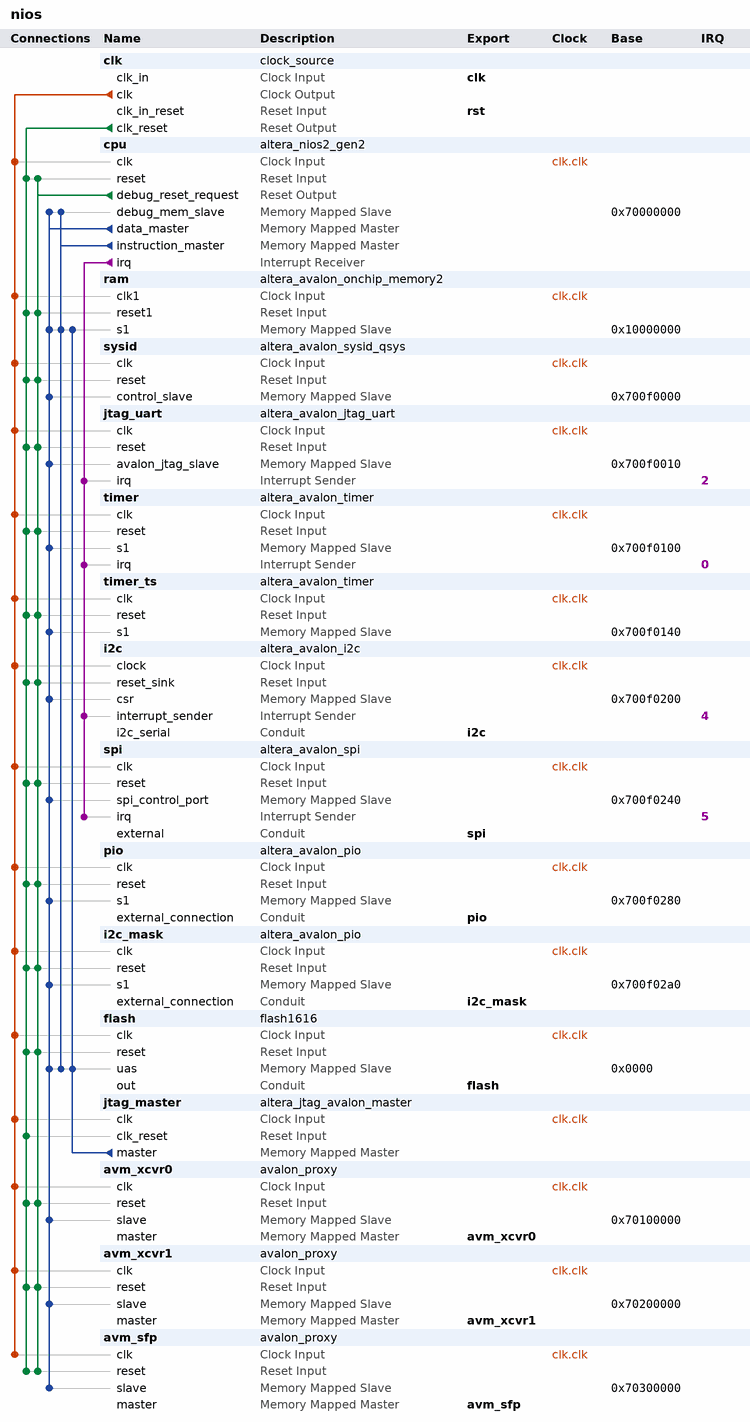
[diagram p0: system contents]
# Platform Designer (Qsys) system nios, Arria 10 10AX115N2F45E1SG
# Parameters at their usual value, and those the tool derives, are not listed.
package require -exact qsys 18.1
create_system nios
set_project_property DEVICE_FAMILY {Arria 10}
set_project_property DEVICE 10AX115N2F45E1SG

add_instance clk clock_source 18.1
set_instance_parameter_value clk clockFrequency 50000000
set_instance_parameter_value clk resetSynchronousEdges DEASSERT

add_instance cpu altera_nios2_gen2 18.1
set_instance_parameter_value cpu dcache_size 2048
set_instance_parameter_value cpu exceptionSlave ram.s1
set_instance_parameter_value cpu icache_size 4096
set_instance_parameter_value cpu impl Tiny
set_instance_parameter_value cpu io_regionbase 1879048192
set_instance_parameter_value cpu io_regionsize 268435456
set_instance_parameter_value cpu resetOffset 98828288
set_instance_parameter_value cpu resetSlave flash.uas

add_instance ram altera_avalon_onchip_memory2 18.1
set_instance_parameter_value ram dataWidth 32
set_instance_parameter_value ram dualPort false
set_instance_parameter_value ram initMemContent true
set_instance_parameter_value ram initializationFileName output_files/nios_ram.hex
set_instance_parameter_value ram memorySize 524288
set_instance_parameter_value ram useNonDefaultInitFile true

add_instance sysid altera_avalon_sysid_qsys 18.1
set_instance_parameter_value sysid id 0

add_instance jtag_uart altera_avalon_jtag_uart 18.1
set_instance_parameter_value jtag_uart simInteractiveOptions NO_INTERACTIVE_WINDOWS

add_instance timer altera_avalon_timer 18.1
set_instance_parameter_value timer alwaysRun true
set_instance_parameter_value timer fixedPeriod true
set_instance_parameter_value timer period 1
set_instance_parameter_value timer periodUnits MSEC
set_instance_parameter_value timer snapshot false

add_instance timer_ts altera_avalon_timer 18.1
set_instance_parameter_value timer_ts period 1
set_instance_parameter_value timer_ts periodUnits MSEC

add_instance i2c altera_avalon_i2c 18.1
set_instance_parameter_value i2c FIFO_DEPTH 4

add_instance spi altera_avalon_spi 18.1
set_instance_parameter_value spi clockPolarity 0
set_instance_parameter_value spi dataWidth 8
set_instance_parameter_value spi masterSPI true
set_instance_parameter_value spi numberOfSlaves 32
set_instance_parameter_value spi targetClockRate 128000

add_instance pio altera_avalon_pio 18.1
set_instance_parameter_value pio bitModifyingOutReg true
set_instance_parameter_value pio direction Output
set_instance_parameter_value pio width 32

add_instance i2c_mask altera_avalon_pio 18.1
set_instance_parameter_value i2c_mask bitModifyingOutReg true
set_instance_parameter_value i2c_mask direction Output
set_instance_parameter_value i2c_mask width 32

add_instance flash flash1616 1.0
set_instance_parameter_value flash address_width 28
set_instance_parameter_value flash clockFrequency 50000000
set_instance_parameter_value flash data_hold 33
set_instance_parameter_value flash rw_wait 144
set_instance_parameter_value flash setup_wait 33

add_instance jtag_master altera_jtag_avalon_master 18.1

add_instance avm_xcvr0 avalon_proxy 1.1
set_instance_parameter_value avm_xcvr0 ADDRESS_UNITS 32
set_instance_parameter_value avm_xcvr0 ADDRESS_WIDTH 18
set_instance_parameter_value avm_xcvr0 DATA_WIDTH 32
set_instance_parameter_value avm_xcvr0 READ_LATENCY 0
set_instance_parameter_value avm_xcvr0 USE_READ_DATA_VALID false

add_instance avm_xcvr1 avalon_proxy 1.1
set_instance_parameter_value avm_xcvr1 ADDRESS_UNITS 32
set_instance_parameter_value avm_xcvr1 ADDRESS_WIDTH 18
set_instance_parameter_value avm_xcvr1 DATA_WIDTH 32
set_instance_parameter_value avm_xcvr1 READ_LATENCY 0
set_instance_parameter_value avm_xcvr1 USE_READ_DATA_VALID false

add_instance avm_sfp avalon_proxy 1.1
set_instance_parameter_value avm_sfp ADDRESS_UNITS 32
set_instance_parameter_value avm_sfp ADDRESS_WIDTH 14
set_instance_parameter_value avm_sfp DATA_WIDTH 32
set_instance_parameter_value avm_sfp READ_LATENCY 0
set_instance_parameter_value avm_sfp USE_READ_DATA_VALID false

# connections
add_connection clk.clk avm_sfp.clk clock
add_connection clk.clk avm_xcvr0.clk clock
add_connection clk.clk avm_xcvr1.clk clock
add_connection clk.clk cpu.clk clock
add_connection clk.clk flash.clk clock
add_connection clk.clk i2c.clock clock
add_connection clk.clk i2c_mask.clk clock
add_connection clk.clk jtag_master.clk clock
add_connection clk.clk jtag_uart.clk clock
add_connection clk.clk pio.clk clock
add_connection clk.clk ram.clk1 clock
add_connection clk.clk spi.clk clock
add_connection clk.clk sysid.clk clock
add_connection clk.clk timer.clk clock
add_connection clk.clk timer_ts.clk clock
add_connection clk.clk_reset avm_sfp.reset reset
add_connection clk.clk_reset avm_xcvr0.reset reset
add_connection clk.clk_reset avm_xcvr1.reset reset
add_connection clk.clk_reset cpu.reset reset
add_connection clk.clk_reset flash.reset reset
add_connection clk.clk_reset i2c.reset_sink reset
add_connection clk.clk_reset i2c_mask.reset reset
add_connection clk.clk_reset jtag_master.clk_reset reset
add_connection clk.clk_reset jtag_uart.reset reset
add_connection clk.clk_reset pio.reset reset
add_connection clk.clk_reset ram.reset1 reset
add_connection clk.clk_reset spi.reset reset
add_connection clk.clk_reset sysid.reset reset
add_connection clk.clk_reset timer.reset reset
add_connection clk.clk_reset timer_ts.reset reset
add_connection cpu.debug_reset_request avm_sfp.reset reset
add_connection cpu.debug_reset_request avm_xcvr0.reset reset
add_connection cpu.debug_reset_request avm_xcvr1.reset reset
add_connection cpu.debug_reset_request cpu.reset reset
add_connection cpu.debug_reset_request flash.reset reset
add_connection cpu.debug_reset_request i2c.reset_sink reset
add_connection cpu.debug_reset_request i2c_mask.reset reset
add_connection cpu.debug_reset_request jtag_uart.reset reset
add_connection cpu.debug_reset_request pio.reset reset
add_connection cpu.debug_reset_request ram.reset1 reset
add_connection cpu.debug_reset_request spi.reset reset
add_connection cpu.debug_reset_request sysid.reset reset
add_connection cpu.debug_reset_request timer.reset reset
add_connection cpu.debug_reset_request timer_ts.reset reset
add_connection cpu.data_master avm_sfp.slave avalon
set_connection_parameter_value cpu.data_master/avm_sfp.slave baseAddress 0x70300000
add_connection cpu.data_master avm_xcvr0.slave avalon
set_connection_parameter_value cpu.data_master/avm_xcvr0.slave baseAddress 0x70100000
add_connection cpu.data_master avm_xcvr1.slave avalon
set_connection_parameter_value cpu.data_master/avm_xcvr1.slave baseAddress 0x70200000
add_connection cpu.data_master cpu.debug_mem_slave avalon
set_connection_parameter_value cpu.data_master/cpu.debug_mem_slave baseAddress 0x70000000
add_connection cpu.data_master flash.uas avalon
set_connection_parameter_value cpu.data_master/flash.uas baseAddress 0x0000
add_connection cpu.data_master i2c.csr avalon
set_connection_parameter_value cpu.data_master/i2c.csr baseAddress 0x700f0200
add_connection cpu.data_master i2c_mask.s1 avalon
set_connection_parameter_value cpu.data_master/i2c_mask.s1 baseAddress 0x700f02a0
add_connection cpu.data_master jtag_uart.avalon_jtag_slave avalon
set_connection_parameter_value cpu.data_master/jtag_uart.avalon_jtag_slave baseAddress 0x700f0010
add_connection cpu.data_master pio.s1 avalon
set_connection_parameter_value cpu.data_master/pio.s1 baseAddress 0x700f0280
add_connection cpu.data_master ram.s1 avalon
set_connection_parameter_value cpu.data_master/ram.s1 baseAddress 0x10000000
add_connection cpu.data_master spi.spi_control_port avalon
set_connection_parameter_value cpu.data_master/spi.spi_control_port baseAddress 0x700f0240
add_connection cpu.data_master sysid.control_slave avalon
set_connection_parameter_value cpu.data_master/sysid.control_slave baseAddress 0x700f0000
add_connection cpu.data_master timer.s1 avalon
set_connection_parameter_value cpu.data_master/timer.s1 baseAddress 0x700f0100
add_connection cpu.data_master timer_ts.s1 avalon
set_connection_parameter_value cpu.data_master/timer_ts.s1 baseAddress 0x700f0140
add_connection cpu.instruction_master cpu.debug_mem_slave avalon
set_connection_parameter_value cpu.instruction_master/cpu.debug_mem_slave baseAddress 0x70000000
add_connection cpu.instruction_master flash.uas avalon
set_connection_parameter_value cpu.instruction_master/flash.uas baseAddress 0x0000
add_connection cpu.instruction_master ram.s1 avalon
set_connection_parameter_value cpu.instruction_master/ram.s1 baseAddress 0x10000000
add_connection jtag_master.master flash.uas avalon
set_connection_parameter_value jtag_master.master/flash.uas baseAddress 0x0000
add_connection jtag_master.master ram.s1 avalon
set_connection_parameter_value jtag_master.master/ram.s1 baseAddress 0x10000000
add_connection cpu.irq i2c.interrupt_sender interrupt
set_connection_parameter_value cpu.irq/i2c.interrupt_sender irqNumber 4
add_connection cpu.irq jtag_uart.irq interrupt
set_connection_parameter_value cpu.irq/jtag_uart.irq irqNumber 2
add_connection cpu.irq spi.irq interrupt
set_connection_parameter_value cpu.irq/spi.irq irqNumber 5
add_connection cpu.irq timer.irq interrupt
set_connection_parameter_value cpu.irq/timer.irq irqNumber 0

# exported interfaces
add_interface avm_sfp avalon master
set_interface_property avm_sfp EXPORT_OF avm_sfp.master
add_interface avm_xcvr0 avalon master
set_interface_property avm_xcvr0 EXPORT_OF avm_xcvr0.master
add_interface avm_xcvr1 avalon master
set_interface_property avm_xcvr1 EXPORT_OF avm_xcvr1.master
add_interface clk clock sink
set_interface_property clk EXPORT_OF clk.clk_in
add_interface flash conduit end
set_interface_property flash EXPORT_OF flash.out
add_interface i2c conduit end
set_interface_property i2c EXPORT_OF i2c.i2c_serial
add_interface i2c_mask conduit end
set_interface_property i2c_mask EXPORT_OF i2c_mask.external_connection
add_interface pio conduit end
set_interface_property pio EXPORT_OF pio.external_connection
add_interface rst reset sink
set_interface_property rst EXPORT_OF clk.clk_in_reset
add_interface spi conduit end
set_interface_property spi EXPORT_OF spi.external

set_interconnect_requirement {$system} qsys_mm.clockCrossingAdapter HANDSHAKE
set_interconnect_requirement {$system} qsys_mm.enableEccProtection FALSE
set_interconnect_requirement {$system} qsys_mm.insertDefaultSlave FALSE
set_interconnect_requirement {$system} qsys_mm.maxAdditionalLatency 1

save_system nios.qsys
